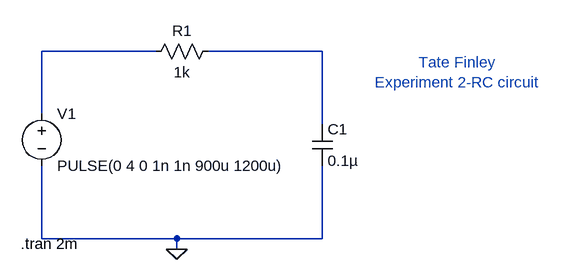
[diagram p0: schematic RC_schematic_ece3060.asc]
RC_schematic_ece3060.asc, the LTspice schematic file:
Version 4
SHEET 1 880 680
WIRE 192 32 16 32
WIRE 448 32 272 32
WIRE 16 128 16 32
WIRE 448 144 448 32
WIRE 16 320 16 208
WIRE 224 320 16 320
WIRE 448 320 448 208
WIRE 448 320 224 320
WIRE 224 336 224 320
FLAG 224 336 0
SYMBOL voltage 16 112 R0
WINDOW 123 0 0 Left 0
WINDOW 39 0 0 Left 0
SYMATTR InstName V1
SYMATTR Value PULSE(0 4 0 1n 1n 900u 1200u)
SYMBOL res 288 16 R90
WINDOW 0 0 56 VBottom 2
WINDOW 3 32 56 VTop 2
SYMATTR InstName R1
SYMATTR Value 1k
SYMBOL cap 432 144 R0
SYMATTR InstName C1
SYMATTR Value 0.1µ
TEXT -16 328 Left 2 !.tran 2m
TEXT 656 64 Center 2 ;Tate Finley\nExperiment 2-RC circuit

The netlist it stands for:
* RC_schematic_ece3060.asc
V1 N001 0 PULSE(0 4 0 1n 1n 900u 1200u)
R1 N002 N001 1k
C1 N002 0 0.1µ
.tran 2m
* Tate Finley
* Experiment 2-RC circuit
.backanno
.end